# EAGLE design cerebro5.11_dbs (EAGLE 9.1.3)
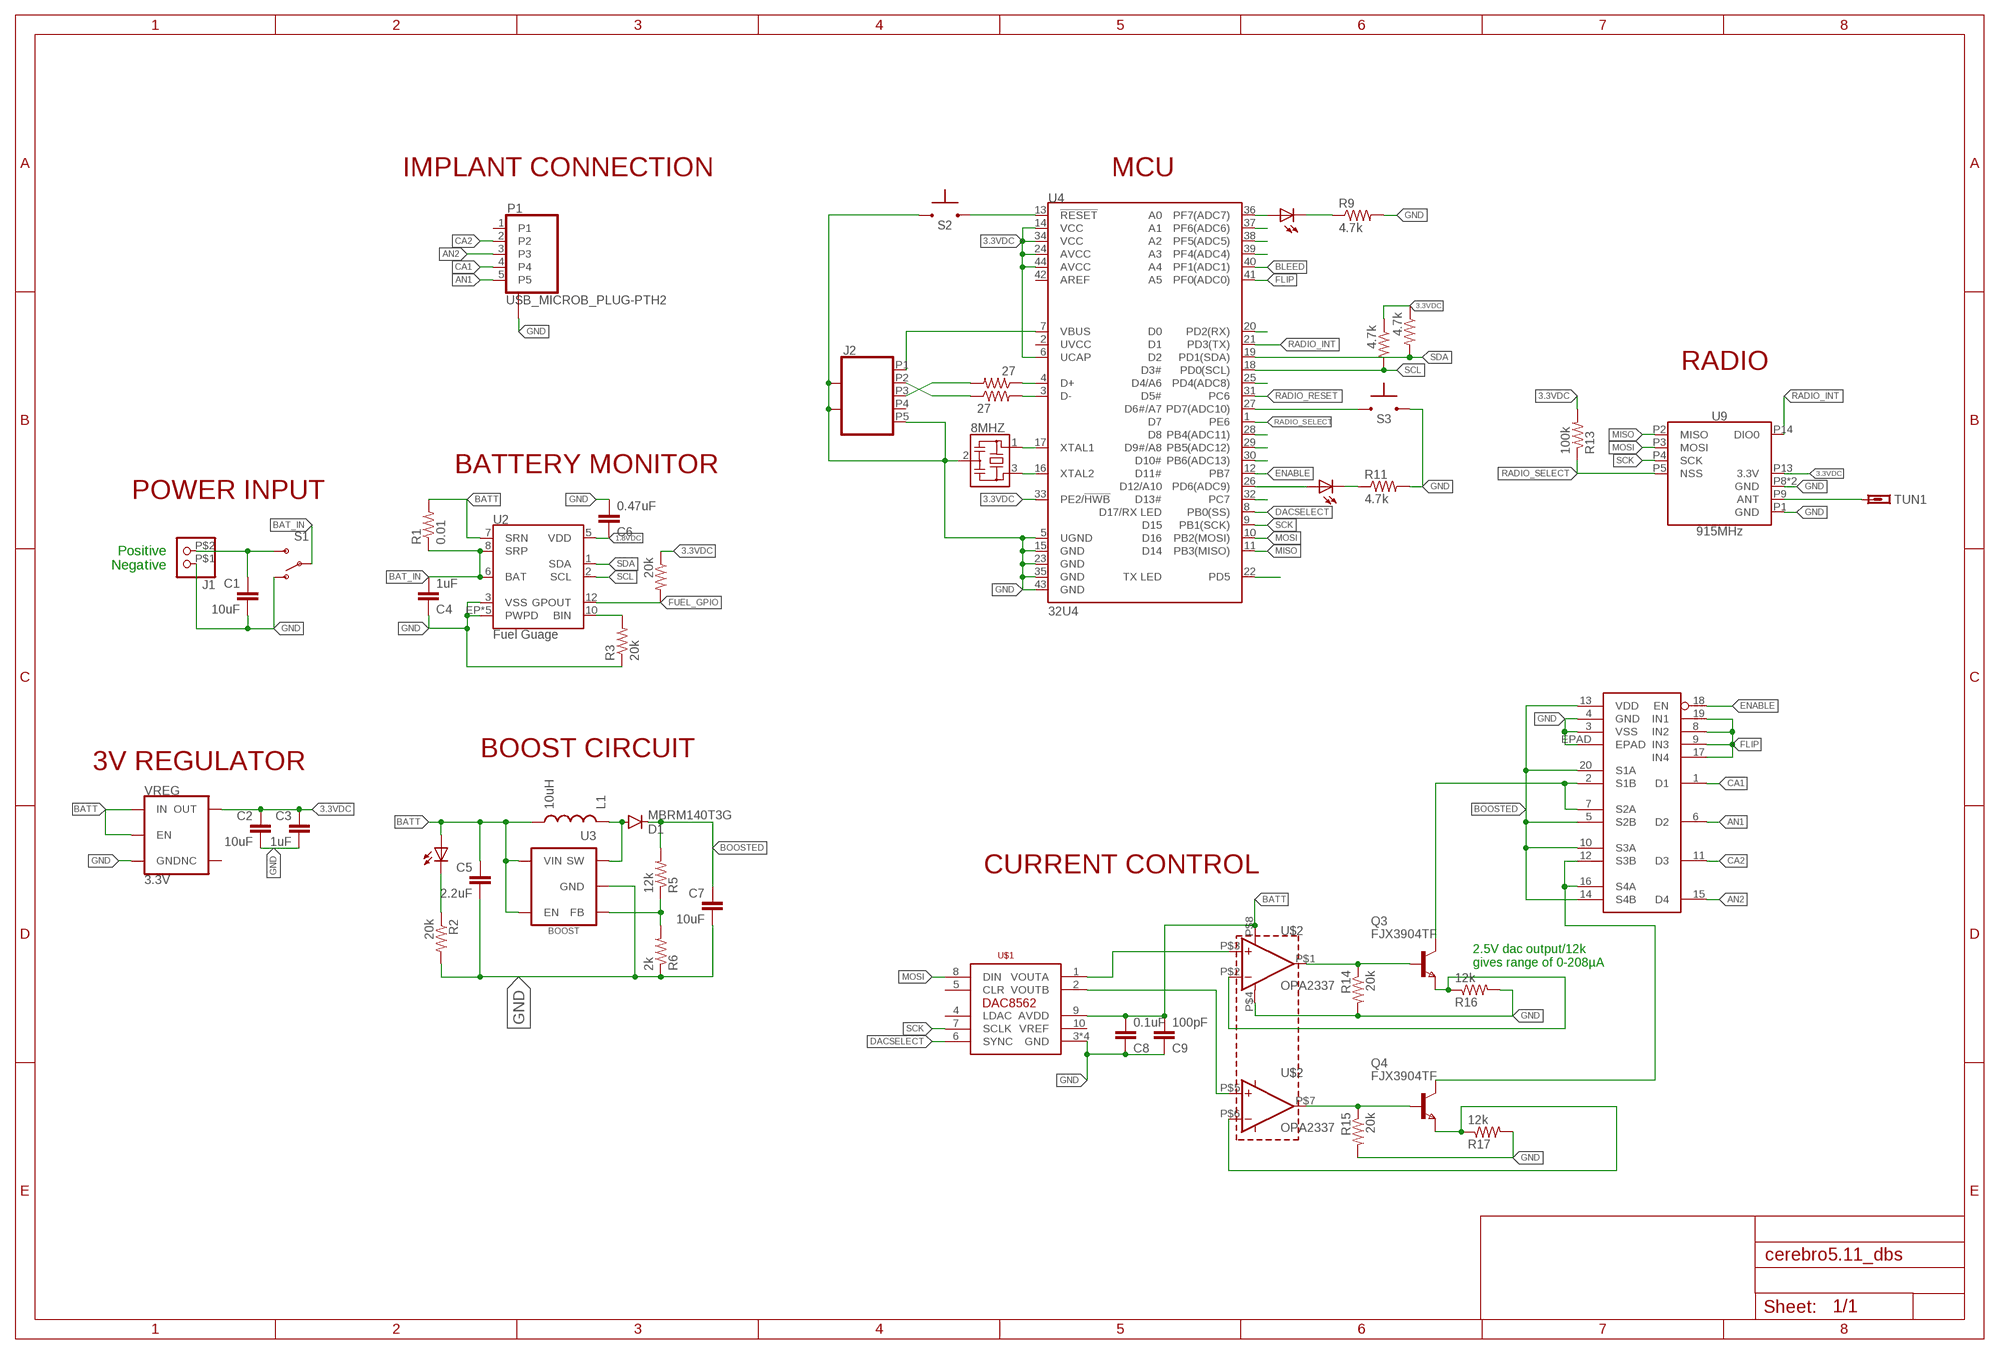
[diagram p0: schematic, sheet 1]

## Parts
8MHZ  RESONATOR_CSTCE_V  [CSTCE_V]
C1  10uF  10UF-0805-10V-10%  [0805]
C2  10uF  10UF-0805-10V-10%  [0805]
C3  1uF  10UF-0805-10V-10%  [0805]
C4  1uF  10UF-0805-10V-10%  [0805]
C5  2.2uF  2.2UF-0805-25V-(+80/-20%)  [0805]
C6  0.47uF  10UF-0805-10V-10%  [0805]
C7  10uF  10UF-0805-10V-10%  [0805]
C8  0.1uF  10UF-0805-10V-10%  [0805]
C9  100pF  10UF-0805-10V-10%  [0805]
D1  MBRM140T3G  DIODEPOWERMITE  [POWERMITE]
J1  JST_2PINMICRO  [MICRO_LOCK_2PIN]
J2  USB_MICRO_SOCKET_HORZ_REINFORCED  [USB_HORZ_REINFORCED_MICRO]
L1  10uH  INDUCTORLQH4  [1812]
LED1  RED  LEDCHIP-LED0603  [CHIP-LED0603]
LED2  YLW  LEDCHIP-LED0603  [CHIP-LED0603]
LED3  YLW  LEDCHIP-LED0603  [CHIP-LED0603]
P1  USB_MICROB_PLUG-PTH2  [MICRO-B-TH]
Q3  FJX3904TF  NPNSOT323  [SOT323]
Q4  FJX3904TF  NPNSOT323  [SOT323]
R1  0.01  RESISTOR1206  [1206]
R2  20k  RESISTOR0603-RES  [0603-RES]
R3  20k  RESISTOR0603-RES  [0603-RES]
R4  20k  RESISTOR0603-RES  [0603-RES]
R5  12k  RESISTOR0805-RES  [0805]
R6  2k  RESISTOR0603-RES  [0603-RES]
R7  27  RESISTOR0603-RES  [0603-RES]
R8  27  RESISTOR0603-RES  [0603-RES]
R9  4.7k  RESISTOR0603-RES  [0603-RES]
R10  4.7k  RESISTOR0603-RES  [0603-RES]
R11  4.7k  RESISTOR0603-RES  [0603-RES]
R12  4.7k  RESISTOR0603-RES  [0603-RES]
R13  100k  RESISTOR0603-RES  [0603-RES]
R14  20k  RESISTOR0603-RES  [0603-RES]
R15  20k  RESISTOR0603-RES  [0603-RES]
R16  12k  RESISTOR0603-RES  [0603-RES]
R17  12k  RESISTOR0603-RES  [0603-RES]
S1  SWITCH-SPDTREINFORCED_SMD  [SWITCH-SPDT-SMD-REINFORCED]
S2  SWITCH-MOMENTARY-NO  [SWITCH_MOMENTARY_XS]
S3  SWITCH-MOMENTARY-NO  [SWITCH_MOMENTARY_XS]
TUN1  ANTENNA  [1X01]
U2  Fuel Guage  BQ27441-G1  [PDSO-N12]
U3  BOOST  BOOST_CONVERTER  [SOT23-5]
U4  32U4  ATMEGA32U4QFN2  [QFN-44-NOPAD]
U9  915MHz  RFM69HCW-915  [RFM69HCW-XXXS2]
U$1  DAC8562  [WSON-10]
U$2  OPA2337  [SOT23-8]
U$3  ADG1434  [LFCSP_5X5]
VREG  3.3V  V_REG_AP2112K-3.3V  [SOT23-5]

## Nets
1.8VDC: C6.1 U2.5(VDD)
3.3VDC: C2.1 C3.1 R4.1 R10.1 R12.1 R13.2 U4.6(UCAP) U4.14(VCC) U4.24(AVCC) U4.33(PE2/!HWB) U4.34(VCC) U4.44(AVCC) U9.P13(3.3V) VREG.5(OUT)
AN1: P1.5 U$3.6(D2)
AN2: P1.3 U$3.15(D4)
BAT_IN: C4.2 R1.1 S1.2(P) U2.6(BAT) U2.8(SRP)
BATT: C5.1 C8.2 C9.2 L1.P$2 L1.P$4 LED1.A R1.2 U2.7(SRN) U3.4(EN) U3.5(VIN) U$1.9(AVDD) U$2.P$8(V+) VREG.1(IN) VREG.3(EN)
BLEED: U4.40(PF1(ADC1))
BOOSTED: C7.1 D1.CATHODE(C) R5.2 U$3.5(S2B) U$3.10(S3A) U$3.13(VDD) U$3.14(S4B) U$3.20(S1A)
CA1: P1.4 U$3.1(D1)
CA2: P1.2 U$3.11(D3)
DACSELECT: U4.8(PB0(SS)) U$1.6(SYNC)
ENABLE: U4.12(PB7) U$3.18(EN)
FLIP: U4.41(PF0(ADC0)) U$3.8(IN2) U$3.9(IN3) U$3.17(IN4) U$3.19(IN1)
FUEL_GPIO: R4.2 U2.12(GPOUT)
GND: 8MHZ.2 C1.2 C2.2 C3.2 C4.1 C5.2 C6.2 C7.2 C8.1 C9.1 J1.P$1 J2.G1 J2.G2 J2.P5 J2.P$1 J2.P$2 P1.P$1(GND_PINS) P1.P$2(GND_PINS) R2.2 R3.1 R6.1 R9.2 R11.2 R14.2 R15.2 R16.2 R17.2 S1.1(O) S2.P$1 S3.P$2 U2.3(VSS) U2.EP1(PWPD) U2.EP2(PWPD) U2.EP3(PWPD) U2.EP4(PWPD) U2.EP(PWPD) U3.2(GND) U4.5(UGND) U4.15(GND) U4.23(GND) U4.35(GND) U4.43(GND) U9.P1(GND) U9.P8(GND) U9.P10(GND) U$1.3(GND) U$1.G1(GND) U$1.G2(GND) U$1.G3(GND) U$2.P$4(V-) U$3.3(VSS) U$3.4(GND) U$3.EPAD VREG.2(GND)
MISO: U4.11(PB3(MISO)) U9.P2(MISO)
MOSI: U4.10(PB2(MOSI)) U9.P3(MOSI) U$1.8(DIN)
N$1: Q3.2(B) R14.1 U$2.P$1(OUTA)
N$2: Q4.2(B) R15.1 U$2.P$7(OUTB)
N$3: Q4.3(E) R17.1 U$2.P$6(INB-)
N$4: C1.1 J1.P$2 S1.3(S)
N$5: Q3.3(E) R16.1 U$2.P$2(INA-)
N$8: LED1.C R2.1
N$9: U4.32(PC7)
N$10: R5.1 R6.2 U3.3(FB)
N$12: 8MHZ.1 U4.17(XTAL1)
N$13: 8MHZ.3 U4.16(XTAL2)
N$14: J2.P1 U4.7(VBUS)
N$15: D1.ANODE(A) L1.P$1 L1.P$3 U3.1(SW)
N$16: R7.1 U4.4(D+)
N$17: R8.2 U4.3(D-)
N$18: J2.P3 R7.2
N$19: J2.P2 R8.1
N$20: LED3.C R11.1
N$21: S3.P$1 U4.27(PD7(ADC10))
N$22: TUN1.1 U9.P9(ANT)
N$23: U4.37(PF6(ADC6))
N$24: LED2.C R9.1
N$25: LED2.A U4.36(PF7(ADC7))
N$26: R3.2 U2.10(BIN)
N$27: U4.22(PD5)
N$28: Q4.1(C) U$3.12(S3B) U$3.16(S4A)
N$29: LED3.A U4.26(PD6(ADC9))
N$30: U4.30(PB6(ADC13))
N$31: U4.25(PD4(ADC8))
N$32: U$1.1(VOUTA) U$2.P$3(INA+)
N$33: U$1.2(VOUTB) U$2.P$5(INB+)
N$34: U4.29(PB5(ADC12))
N$36: Q3.1(C) U$3.2(S1B) U$3.7(S2A)
N$37: U4.28(PB4(ADC11))
N$39: U4.20(PD2(RX))
N$42: U4.39(PF4(ADC4))
N$44: U4.38(PF5(ADC5))
RADIO_INT: U4.21(PD3(TX)) U9.P14(DIO0)
RADIO_RESET: U4.31(PC6)
RADIO_SELECT: R13.1 U4.1(PE6) U9.P5(NSS)
RESET: S2.P$2 U4.13(!RESET)
SCK: U4.9(PB1(SCK)) U9.P4(SCK) U$1.7(SCLK)
SCL: R10.2 U2.2(SCL) U4.18(PD0(SCL))
SDA: R12.2 U2.1(SDA) U4.19(PD1(SDA))
Unconnected: J2.P4 P1.1 U4.2(UVCC) U4.42(AREF) U$1.4(LDAC) U$1.5(CLR) U$1.10(VREF) VREG.4(NC)

## Notes on the sheet
- IMPLANT CONNECTION | MCU
- RADIO
- BATTERY MONITOR
- POWER INPUT
- Positive
- Negative
- BOOST CIRCUIT
- 3V REGULATOR
- CURRENT CONTROL
- 2.5V dac output/12k 
  gives range of 0-208µA

## Library data of the parts
8MHZ = Cerebro-library:RESONATOR: 16 MHz Resonator(Murata p/n CSTCE16M0V53-R0) Digikey: 490-1198-1-ND <http://www.digikey.com/product-search/en?keywords=490-1198-1-nd>
C1 C2 C7 = Cerebro-library:10UF: 10.0µF ceramic capacitors A capacitor is a passive two-terminal electrical component used to store electrical energy temporarily in an electric field.; PROD_ID: CAP-11330
C3 C4 C6 C8 C9 = Cerebro-library:10UF: 10.0µF ceramic capacitors A capacitor is a passive two-terminal electrical component used to store electrical energy temporarily in an electric field.; PROD_ID: CAP-11330; VALUE: 10uF
C5 = Cerebro-library:2.2UF: 2.2µF ceramic capacitors A capacitor is a passive two-terminal electrical component used to store electrical energy temporarily in an electric field.; PROD_ID: CAP-11624
D1 = Cerebro-library:DIODE: Diode These are standard reverse protection diodes and small signal diodes. SMA package can handle up to about 1A. SOD-323 can handle about 200mA. What the SOD-323 package when ordering, there are some mfgs out there that are 5-pin packages.
J1 = Cerebro-library:JST_2PIN: JST 2-Pin Connectors of various flavors SMT-RA (S2B-PH-SM4) 4UConnector #17311 SMT (B2B-PH-SM4) THM-RA (S2B-PH) THM (B2B-PH)
J2 = Cerebro-library:USB_MICRO_SOCKET: horizontal socket. Digikey 609-4616-1-ND
L1 = Cerebro-library:INDUCTOR: Inductors Basic Inductor/Choke - 0603 and 1206. Footprints are not proven and vary greatly between part numbers. SRN6045- 33uH, 20% 1.4A SDR0403-560KL - 56uH, 10%, 500mA RMS/740mA peak
LED1-LED3 = led:LED: LED OSRAM: - CHIPLED LG R971, LG N971, LY N971, LG Q971, LY Q971, LO R971, LY R971 LH N974, LH R974 LS Q976, LO Q976, LY Q976 LO Q996 - Hyper CHIPLED LW Q18S LB Q993, LB Q99A, LB R99A - SideLED LS A670, LO A670, LY A670, LG A670, LP A670 LB A673, LV A673, LT A673, LW A673 LH A674 LY A675 LS A676, LA A676, LO A676, LY A676, LW A676 LS A679, LY A679, LG A679 - Hyper Micro SIDELED® LS Y876, LA Y876, LO Y876, LY Y876 LT Y87S - SmartLED LW L88C, LW L88S LB L89C, LB L89S, LG L890 LS L89K, LO L89K, LY L89K LS L896, LA L896, LO L896, LY L896 - TOPLED LS T670, LO T670, LY T670, LG T670, LP T670 LSG T670, LSP T670, LSY T670, LOP T670, LYG T670 LG T671, LOG T671, LSG T671 LB T673, LV T673, LT T673, LW T673 LH T674 LS T676, LA T676, LO T676, LY T676, LB T676, LH T676, LSB T676, LW T676 LB T67C, LV T67C, LT T67C, LS T67K, LO T67K, LY T67K, LW E67C LS E67B, LA E67B, LO E67B, LY E67B, LB E67C, LV E67C, LT E67C LW T67C LS T679, LY T679, LG T679 LS T770, LO T770, LY T770, LG T770, LP T770 LB T773, LV T773, LT T773, LW T773 LH T774 LS E675, LA E675, LY E675, LS T675 LS T776, LA T776, LO T776, LY T776, LB T776 LHGB T686 LT T68C, LB T68C - Hyper Mini TOPLED® LB M676 - Mini TOPLED Santana® LG M470 LS M47K, LO M47K, LY M47K Source: http://www.osram.convergy.de LUXEON: - LUMILED® LXK2-PW12-R00, LXK2-PW12-S00, LXK2-PW14-U00, LXK2-PW14-V00 LXK2-PM12-R00, LXK2-PM12-S00, LXK2-PM14-U00 LXK2-PE12-Q00, LXK2-PE12-R00, LXK2-PE12-S00, LXK2-PE14-T00, LXK2-PE14-U00 LXK2-PB12-K00, LXK2-PB12-L00, LXK2-PB12-M00, LXK2-PB14-N00, LXK2-PB14-P00, LXK2-PB14-Q00 LXK2-PR12-L00, LXK2-PR12-M00, LXK2-PR14-Q00, LXK2-PR14-R00 LXK2-PD12-Q00, LXK2-PD12-R00, LXK2-PD12-S00 LXK2-PH12-R00, LXK2-PH12-S00 LXK2-PL12-P00, LXK2-PL12-Q00, LXK2-PL12-R00 Source: www.luxeon.com KINGBRIGHT: KA-3528ASYC Source: www.kingbright.com
P1 = Cerebro-library:USB_MICROB_PLUG: USB Micro-B connectors Some male, some female. Watch your step!
Q3 Q4 = Cerebro-library:NPNSOT323: NPN TRANSISTOR; MPN: DSS4160U-7; OC_FARNELL: 1710696; OC_NEWARK: 25R4558
R1-R17 = Cerebro-library:RESISTOR: Resistor Basic schematic elements and footprints for 0603, 1206, and PTH resistors.
S1 = Cerebro-library:SWITCH-SPDT: SPDT Switch slide switch: AYZ0102AGRLC <http://www.digikey.com/product-detail/en/c-k/AYZ0102AGRLC/401-2012-1-ND/1640121> vertical toggle: ATE1D-2M3-10-Z <http://www.digikey.com/product-search/en?keywords=ATE1D-2M3-10-Z> horizontal toggle: ATE1D-5M3-10-Z <http://www.digikey.com/product-search/en?keywords=ATE1D-5M3-10-Z>
S2 S3 = Cerebro-library:SWITCH-MOMENTARY-NO
TUN1 = Cerebro-library:ANTENNA
U2 = Cerebro-library:BQ27441-G1: Texas Instruments BQ27441-G1 LiPo Battery Fuel Gauge The Texas Instruments bq27441-G1 fuel gauge is a microcontroller peripheral that provides system-side fuel gauging for single-cell Li-Ion batteries. The device requires minimal user configuration and system microcontroller firmware development. The bq27441-G1 battery fuel gauge uses the patented Impedance Track™ algorithm for fuel gauging, and provides information such as remaining battery capacity (mAh), state-of-charge (%), and battery voltage (mV). Datasheet <http://www.ti.com/product/BQ27441-G1/datasheet> SparkFun Products SparkFun Battery Babysitter <https://www.sparkfun.com/products/13777> (PRT-13777); PROD_ID: IC-13220
U3 = Cerebro-library:BOOST_CONVERTER
U4 = Cerebro-library:ATMEGA32U4: Atmel MCU, 32KByte Atmel 44-pin 8-bit Microcontroller with 32KBytes of ISP Flash and USB Controller Datasheet <http://cdn.sparkfun.com/datasheets/Dev/Arduino/Boards/ATMega32U4.pdf> SparkFun Products LilyPad Arduino USB - ATmega32U4 Board <https://www.sparkfun.com/products/12049> (DEV-12049) Pro Micro - 5V/16MHz <https://www.sparkfun.com/products/12640> (DEV-12640) Pro Micro - 3.3V/8MHz <https://www.sparkfun.com/products/12587> (DEV-12587) Fio v3 - ATmega32U4 <https://www.sparkfun.com/products/11520> (DEV-11520) Qduino Mini <https://www.sparkfun.com/products/13614> (DEV-13614) Makey Makey - Standard Kit <https://www.sparkfun.com/products/11511> (WIG-11511) Makey Makey Deluxe Kit <https://www.sparkfun.com/products/11519> (WIG-11519); PROD_ID: IC-10828
U9 = Cerebro-library:RFM69H: Hope RF RFM69H ISM Transceiver Module The RFM69H is a transceiver module capable of operation over a wide frequency range, including the 315,433,868 and 915MHz license-free ISM (Industry Scientific and Medical) frequency bands. All major RF communication parameters are programmable and most of them can be dynamically set. The RFM69H offers the unique advantage of programmable narrow-band and wide- band communication modes. The RFM69H is optimized for low power consumption while offering high RF output power and channelized operation.Compliance ETSI and FCC regulations. Datasheet <http://www.hoperf.cn/upload/docs/RF/SX/RFM69H_DataSheet_v1.3.pdf> SparkFun Products RFM69HCW Wireless Transceiver - 915MHz <https://www.sparkfun.com/products/13909> (COM-13909) RFM69HCW Wireless Transceiver - 434MHz <https://www.sparkfun.com/products/13910> (COM-13910) SparkFun RFM69 Breakout (915MHz) <https://www.sparkfun.com/products/12775> (WRL-12775) SparkFun RFM69 Breakout (434MHz) <https://www.sparkfun.com/products/12823> (WRL-12823); PROD_ID: IC-11997
U$1 = Cerebro-library:DAC8562: DAC8562
U$2 = Cerebro-library:OPA2337: Texas instruments OPA2337 dual op-amp. SOT23-8 Digikey 296-26252-1-ND <https://www.digikey.com/products/en?keywords=296-26252-1-ND>
U$3 = Cerebro-library:ADG1434
VREG = Cerebro-library:V_REG_AP2112: AP2112 - 600mA CMOS LDO Regulator w/ Enable The AP2112 is CMOS process low dropout linear regulator with enable function, the regulator delivers a guaranteed 600mA (min.) continuous load current. Features Output Voltage Accuracy: ±1.5% Output Current: 600mA (Min.) Foldback Short Current Protection: 50mA Enable Function to Turn ON/OFF VOUT Low Dropout Voltage (3.3V): 250mV (Typ.) @IOUT=600mA Excellent Load Regulation: 0.2%/A (Typ.) Excellent Line Regulation: 0.02%/V (Typ.) Low Quiescent Current: 55μA (Typ.) Low Standby Current: 0.01μA (Typ.) Low Output Noise: 50μVRMS PSRR: 100Hz -65dB, 1kHz -65dB OTSD Protection Stable with 1.0μF Flexible Cap: Ceramic, Tantalum and Aluminum Electrolytic Operation Temperature Range: -40°C to 85°C ESD: MM 400V, HBM 4000V; DIGIKEY: AP2112K-3.3TRG1DICT-ND; PROD_ID: VREG-12457

## Board
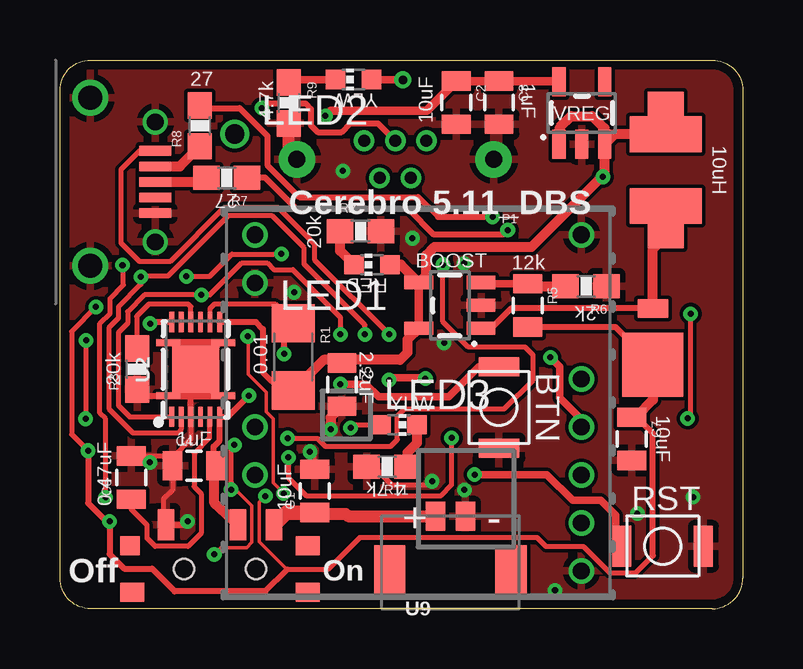
[diagram p1: board, top side]
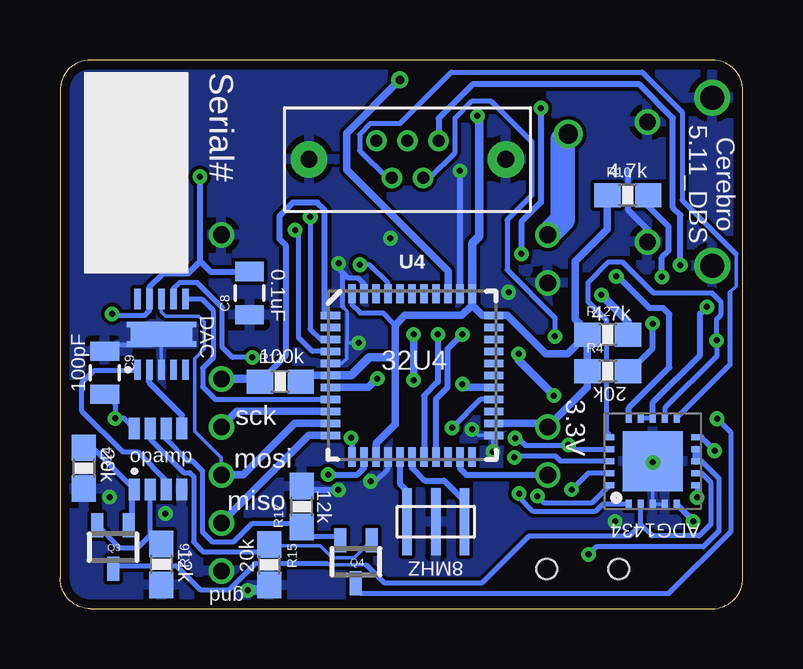
[diagram p2: board, bottom side, seen from below]

Size 28.45 x 22.86 mm. Coordinates in mm from the lower left corner, seen from the top.
Outline: 27.18,0 1.27,0 arc-90 0,1.27 0,21.59 arc-90 1.27,22.86 27.18,22.86 arc-90 28.45,21.59 28.45,1.27 arc-90 27.18,0
Copper layers (1*16): Top 0.0356mm / dielectric 1.5011mm / Bottom 0.0356mm
Design rules "LaenPCBOrder *": minimum track width 6mil, minimum drill 8mil, track to track 6mil, track to pad 6mil, pad to pad 6mil, via to via 6mil, smd to smd 0mil, copper to edge 15mil, drill to drill 6mil, minimum pad ring 7mil, minimum via ring 7mil, stop-mask expansion 3mil, vias tented up to drill 25mil, thermal gap 10mil
bRestrict: area 23.6,14.9 to 26.9,21.6

### Footprints (pad centres in the part's own frame; a part is rotated, then mirrored left to right if it is on the bottom)
CSTCE_V = smd 0.4 x 2.794: 1 -1.2,0; 2 0,0; 3 1.2,0
0805 = smd 0.8 x 1.2: 1 -0.9,0; 2 0.9,0
POWERMITE = smd 0.762 x 1.27: ANODE 0.699,0 | smd 2.667 x 2.54: CATHODE -1.651,0
MICRO_LOCK_2PIN = smd 0.8 x 1.2: P$1 -0.625,0; P$2 0.625,0 | smd 1.3 x 2.15: P$3 -2.525,2.295; P$4 2.525,2.295
USB_HORZ_REINFORCED_MICRO = drill 1: G1 -3.5,0; G2 3.5,0 | smd 0.4 x 1.35: P1 -1.3,2.7; P2 -0.65,2.7; P3 0,2.7; P4 0.65,2.7; P5 1.3,2.7 | drill 0.7: P$1 -2.5,2.7; P$2 2.5,2.7
1812 = smd 1.499 x 2.997: P$1 -1.499,0; P$2 1.499,0 | smd 1.016 x 1.499: P$3 -2.756,0; P$4 2.756,0
CHIP-LED0603 = smd 0.8 x 0.8: A 0,-0.75; C 0,0.75
MICRO-B-TH = drill 0.5 pad 0.813: 1 -1.3,-0.775; 2 -0.65,0.775; 3 0,-0.775; 4 0.65,0.775; 5 1.3,-0.775 | drill 0.7 pad 1.524: P$1 -4.1,0; P$2 4.1,0
SOT323 = smd 0.5 x 1: 1 0,0.9; 2 -0.65,-0.9; 3 0.65,-0.9
1206 = smd 1.6 x 1.8: 1 -1.4,0; 2 1.4,0
0603-RES = smd 1.1 x 1: 1 -0.85,0; 2 0.85,0
SWITCH-SPDT-SMD-REINFORCED = smd 0.7 x 1.3: 1 -2.25,1.85; 2 0.75,1.85; 3 2.25,1.85 | smd 0.8 x 0.8: P$4 -3.75,0.965 | smd 1 x 0.8: P$5 -3.65,-0.965; P$6 3.65,0.965; P$7 3.65,-0.965 | hole 0.85: -1.5,0; 1.5,0
SWITCH_MOMENTARY_XS = smd 0.8 x 1.7: P$1 -1.7,0; P$2 1.7,0
1X01 = drill 0.8: 1 0,0
PDSO-N12 = smd 0.2 x 0.85: 1 -1,-1.975; 2 -0.6,-1.975; 3 -0.2,-1.975; 4 0.2,-1.975; 5 0.6,-1.975; 6 1,-1.975; 7 1,1.975; 8 0.6,1.975; 9 0.2,1.975; 10 -0.2,1.975; 11 -0.6,1.975; 12 -1,1.975 | smd 1.95 x 1.95: EP 0,0 | smd 1 x 0.25: EP1 -1.15,1.1; EP2 -1.15,-1.1; EP3 1.15,-1.1; EP4 1.15,1.1
SOT23-5 = smd 0.55 x 1.2: 1 -0.95,-1.3; 2 0,-1.3; 3 0.95,-1.3; 4 0.95,1.3; 5 -0.95,1.3
QFN-44-NOPAD = smd 0.8 x 0.3: 1 -3.4,2.5; 2 -3.4,2; 3 -3.4,1.5; 4 -3.4,1; 5 -3.4,0.5; 6 -3.4,0; 7 -3.4,-0.5; 8 -3.4,-1; 9 -3.4,-1.5; 10 -3.4,-2; 11 -3.4,-2.5; 23 3.4,-2.5; 24 3.4,-2; 25 3.4,-1.5; 26 3.4,-1; 27 3.4,-0.5; 28 3.4,0; 29 3.4,0.5; 30 3.4,1; 31 3.4,1.5; 32 3.4,2; 33 3.4,2.5 | smd 0.3 x 0.8: 12 -2.5,-3.4; 13 -2,-3.4; 14 -1.5,-3.4; 15 -1,-3.4; 16 -0.5,-3.4; 17 0,-3.4; 18 0.5,-3.4; 19 1,-3.4; 20 1.5,-3.4; 21 2,-3.4; 22 2.5,-3.4; 34 2.5,3.4; 35 2,3.4; 36 1.5,3.4; 37 1,3.4; 38 0.5,3.4; 39 0,3.4; 40 -0.5,3.4; 41 -1,3.4; 42 -1.5,3.4; 43 -2,3.4; 44 -2.5,3.4
RFM69HCW-XXXS2 = drill 0.7: P1 -6.8,7; P2 -6.8,5; P3 -6.8,3; P4 -6.8,1; P5 -6.8,-1; P8 -6.8,-7; P9 6.8,-7; P10 6.8,-5; P13 6.8,1; P14 6.8,3
WSON-10 = smd 0.28 x 0.85: 1 -1,-1.475; 2 -0.5,-1.475; 3 0,-1.475; 4 0.5,-1.475; 5 1,-1.475; 6 1,1.475; 7 0.5,1.475; 8 0,1.475; 9 -0.5,1.475; 10 -1,1.475 | smd 2.55 x 0.59: G1 0,0 | smd 2.91 x 0.23: G2 0,0.41; G3 0,-0.41
SOT23-8 = smd 0.889 x 0.457: P$1 -1.27,0.991; P$2 -1.27,0.33; P$3 -1.27,-0.33; P$4 -1.27,-0.991; P$5 1.27,-0.991; P$6 1.27,-0.33; P$7 1.27,0.33; P$8 1.27,0.991
LFCSP_5X5 = smd 0.4 x 0.25: 1 -1.8,1; 2 -1.8,0.5; 3 -1.8,0; 4 -1.8,-0.5; 5 -1.8,-1; 11 1.8,-1; 12 1.8,-0.5; 13 1.8,0; 14 1.8,0.5; 15 1.8,1 | smd 0.25 x 0.4: 6 -1,-1.8; 7 -0.5,-1.8; 8 0,-1.8; 9 0.5,-1.8; 10 1,-1.8; 16 1,1.8; 17 0.5,1.8; 18 0,1.8; 19 -0.5,1.8; 20 -1,1.8 | smd 2.5 x 2.5: EPAD 0,0

### Placement (x,y rotation side)
8MHZ  12.79,3.62 180 bottom
C1  10.62,4.9 90 top
C2  16.51,21.08 270 top
C3  18.29,21.08 270 top
C4  5.59,5.96 0 top
C5  11.75,9.33 270 top
C6  2.97,5.46 90 top
C7  23.83,7.07 270 top
C8  20.55,13.14 90 bottom
C9  26.58,9.83 270 bottom
D1  24.7,11.81 90 top
J1  16.27,3.85 180 top
J2  1.27,17.78 270 top
L1  25.25,18.28 90 top
LED1  13,14.33 90 top
LED2  12.23,22.05 90 top
LED3  14.12,7.66 270 top
P1  13.97,18.72 180 top
Q3  26.24,2.57 180 bottom
Q4  16.12,1.96 180 bottom
R1  9.72,10.49 270 top
R2  12.52,15.72 0 top
R3  3.21,9.98 90 top
R4  5.63,9.89 0 bottom
R5  19.49,12.64 270 top
R6  21.92,13.44 180 top
R7  6.95,17.96 180 top
R8  5.83,20.12 90 top
R9  9.54,21.07 270 top
R10  4.79,17.22 0 bottom
R11  13.63,5.92 180 top
R12  5.63,11.42 0 bottom
R13  19.27,9.46 0 bottom
R14  27.46,5.85 270 bottom
R15  19.74,1.83 270 bottom
R16  24.22,1.84 270 bottom
R17  18.38,4.25 90 bottom
S1  6.67,1.65 0 top
S2  25.11,2.6 180 top
S3  18.29,8.38 270 top
TUN1  7.28,19.77 0 bottom
U2  5.65,9.97 0 top
U3  16.24,12.64 90 top
U4  13.78,9.72 0 bottom
U9  14.92,8.57 180 top
U$1  24.22,11.43 0 bottom
U$2  24.36,6.24 90 bottom
U$3  3.75,6.15 90 bottom
VREG  21.74,20.65 0 top

### Tracks (layer width: path | path; a pad name or v marks a point on that pad's centre or on a via)
1.8VDC
  Top 0.152: U2.5 6.22,7.97
  Top 0.203: 6.22,7.97 6.22,7.11 5.59,6.48 5.59,5.08 5.88,4.79 5.88,3.13 5.34,2.6 3.96,2.6 3.63,2.93 3.63,3.48 2.97,4.14 C6.1
3.3VDC  (via drill 0.25)
  Top 0.305: 20.76,21.98 VREG.5
  Top 0.356: 20.76,21.98 C3.1 C2.1 15.28,20.75 11.28,20.75 v11.06,20.54
  Bottom 0.152: 6.41,11.49 R12.1
  Bottom 0.203: 14.48,11.81 14.99,12.32 15.94,12.32 16.28,12.66 16.28,12.67 U4.44 | 6.48,9.93 R4.1
  Bottom 0.254: 9.87,7.71 9.86,7.73
  Bottom 0.305: U4.14 15.28,6.88 14.48,7.68 14.48,10.48 14.48,11.81 14.07,12.22 11.7,12.22 11.28,12.63 10.86,12.22 U4.33 9.81,12.22 8.2,10.61 7.28,10.61 R12.1 6.48,9.93 6.48,9.22 U9.P13 8.28,7.73 9.86,7.73 | 6.41,11.49 6.99,12.06 6.99,14.46 5.64,15.81 R10.1 | U4.6 18.16,9.72 R13.2 | U4.24 9.87,7.71
  Bottom 0.356: U4.6 16.32,9.72 15.56,10.48 14.48,10.48 | 11.28,12.63 U4.34 11.28,15.22 10.99,15.52 10.99,20.46 v11.06,20.54
AN1  (via drill 0.25)
  Top 0.203: v1.9,4.63 1.9,7.9 1.66,8.15 1.66,11.88 2.08,12.31 2.08,12.92 2.64,13.47 2.64,14.28 v2.6,14.31
  Bottom 0.203: U$3.6 1.9,5.1 v1.9,4.63
  Bottom 0.254: v2.6,14.31 2.6,16.4 2.91,16.71 2.91,20.43 4.32,21.84 11.25,21.84 12.67,20.43 P1.5
AN2  (via drill 0.25)
  Top 0.203: v5.27,13.84 6.23,13.84 7.16,14.77 v9.21,14.77 v9.22,14.78
  Top 0.254: P1.3 13.25,20.22 12.1,20.22 11.73,19.85 10.74,19.85 10.46,20.14 10.46,20.82 10.23,21.05 8.6,21.05 v8.41,20.85
  Bottom 0.254: v8.41,20.85 8.41,16.93 9.22,16.12 v9.22,14.78 | U$3.15 4.75,8.36 3.06,10.05 3.06,12.27 3.31,12.52 3.88,12.52 5.21,13.84 v5.27,13.84
BAT_IN  (via drill 0.25)
  Top 0.203: U2.8 6.25,12.51 6.44,12.7 8.96,12.7 9.64,12.03
  Top 0.254: C4.2 6.4,5.96 | v7.87,8.88 6.99,8 U2.6 6.65,7 6.4,6.75 6.4,5.96 | v9.34,10.62 9.34,11.51 R1.1 | 6.4,5.96 6.4,5.64 6.44,5.64
  Top 0.305: 9.64,12.03 R1.1
  Top 0.406: S1.2 6.44,4.41 6.44,5.64
  Bottom 0.33: v7.87,8.88 v7.87,8.89 9.34,10.35 v9.34,10.62
BATT  (via drill 0.25, 0.25 pad 0.25)
  Top 0.203: v26.15,7.92 26.28,8.05 v26.28,12.28 | VREG.1 20.83,19.39
  Top 0.254: L1.P$4 L1.P$2 | 9.2,9.09 8.46,9.83 8.46,11.65 8.16,11.94 U2.7
  Top 0.356: U3.4 U3.5 | 9.2,9.09 R1.2
  Top 0.406: L1.P$2 23.12,19.77 23.01,19.66 VREG.3 | U3.5 14.48,11.22 14.48,10.67 14.17,10.36 11.75,10.36 C5.1 11.63,10.36 10.99,10.36 R1.2 | VREG.3 22.69,18.07 v22.62,18 22.57,18 19.65,15.07 15.6,15.07 15.26,14.73 15.26,13.9 U3.4 14.2,14.33 LED1.A | 20.83,19.39 20.83,20.05 21.3,20.52 22.17,20.52 22.68,20.02 22.68,19.36 VREG.3
  Bottom 0.152: C9.2 26.15,8.5
  Bottom 0.203: U$2.P$8 25.77,7.92 v26.15,7.92 26.15,8.5 | U$1.9 24.72,12.42 24.93,12.21 26.2,12.21 v26.28,12.28
  Bottom 0.254: U$1.9 24.72,13.38 24.13,13.97 23.11,13.97 22.61,14.48 | v22.62,18 22.61,17.98 22.61,14.48 | 22.61,14.48 22.17,14.04 C8.2
BOOSTED  (via drill 0.25)
  Top 0.152: v8.56,4.69 8.31,4.44 8.31,2.79 9.47,1.63
  Top 0.203: v1.5,12.57 0.48,11.55 0.48,7.26 v1.17,6.58 | 24.7,2.21 24,1.5 22.9,1.5 21.82,2.58 20.25,2.58 19.88,2.96 12.48,2.96 11.15,1.63 9.47,1.63 | 8.55,0.72 8.56,0.72
  Top 0.254: C7.1 23.93,8.08 24,8 24.7,7.3 24.7,6.69 24.7,2.21 | v1.17,6.58 1.17,4.39 1.93,3.63 v2.07,3.63 2.07,2.27 2.67,1.66 3.83,1.66 4.78,0.72 8.55,0.72 | R5.2 23.12,11.74 D1.CATHODE | 8.56,0.72 9.47,1.63
  Top 0.406: D1.CATHODE 24.7,8.7 24,8
  Bottom 0.203: U$3.14 U$3.13 | U$3.20 6.3,4.4 8.27,4.4 v8.56,4.69
  Bottom 0.254: U$3.5 2.07,3.67 v2.07,3.63 | U$3.13 3.75,8.6 1.78,10.57 1.78,12.29 v1.5,12.57 | v1.17,6.58 1.47,6.88 1.47,6.89 1.73,7.15 U$3.10
CA1  (via drill 0.25)
  Top 0.152: v7.82,11.34 7.84,11.33 7.84,9.77 8.59,9.02 8.59,8.2 8.88,7.9 8.88,5.24 v9.32,4.79
  Bottom 0.203: v7.82,11.34 7.82,12.13 9.82,14.12 9.82,16.2 8.79,17.23 8.79,19.44 10.5,21.16 11.27,21.16 11.99,20.43 11.99,19 13.04,17.95 P1.4 | U$3.1 5.84,4.35 6.15,4.04 8.73,4.04 9.32,4.63 v9.32,4.79
CA2
  Bottom 0.152: 0.28,14.77 0.28,13.44 0.54,13.18
  Bottom 0.2: U$3.11 0.54,10.16 0.54,13.18
  Bottom 0.203: 0.28,14.77 2.53,17.02 2.53,20.69 4.19,22.35 12.14,22.35 14.28,20.22 15.51,20.22 15.96,19.77 15.96,19.09 14.82,17.95 P1.2
DACSELECT
  Bottom 0.203: U$1.6 22.55,12.9 22.07,12.43 22.07,10.45 22.5,10.02 22.5,9.25 21.96,8.71 17.19,8.71 U4.8
ENABLE  (via drill 0.25)
  Top 0.203: v16.32,7.11 16.32,5.16 15.88,4.71 10.26,4.71 9.52,5.45 v9.52,6.3
  Bottom 0.203: U$3.18 7.59,6.15 7.8,6.35 9.46,6.35 v9.52,6.3
  Bottom 0.254: v16.32,7.11 16.28,7.07 U4.12
FLIP  (via drill 0.25)
  Top 0.152: v6.43,2.26 6.71,2.54 7.78,2.54 8,2.76 8,4.29 7.33,4.96 v7.13,4.96
  Top 0.203: v7.13,4.96 7.13,5.24 7.14,5.25 7.14,6.7 v7.27,6.82 | v9.49,7.1 10.72,7.1 11.05,6.77 13.79,6.77 14.05,7.04 14.05,8.01 14.37,8.32 18.51,8.32 19.71,9.53 19.71,10.57 19.38,10.9 17.02,10.9 15.95,11.96 v15.95,14.33
  Bottom 0.203: U$3.19 6.44,5.65 v7.13,4.96 | U$3.17 7.09,6.65 v7.27,6.82 7.3,6.79 9.05,6.79 9.36,7.1 v9.49,7.1 | v6.43,2.26 6.11,2.58 1.64,2.58 0.98,3.24 0.98,5.42 1.71,6.15 U$3.8 | U4.41 14.78,13.55 15.56,14.33 v15.95,14.33
  Bottom 0.305: U$3.9 U$3.8
FUEL_GPIO  (via drill 0.25)
  Top 0.152: v3.76,11.87 3.83,11.94
  Top 0.254: 3.83,11.94 U2.12
  Bottom 0.254: R4.2 4.71,9.89 3.76,10.85 v3.76,11.87
GND  (via drill 0.25)
  Top 0.152: U2.EP2 4.55,8.87 arc90 U2.EP | R3.1 3.28,8.87 | U2.EP4 6.75,11.07 6.1,10.41 | 6.1,10.41 U2.EP | U2.EP1 5.44,11.07 arc-90 6.1,10.41 | U2.EP3 6.75,8.87 arc-90 U2.EP | 4.31,3.58 arc90 S1.1 | C1.2 10.62,6.34 v10.41,6.54 | 4.28,6.36 4.01,6.36 v3.75,6.1
  Top 0.203: C6.2 4.28,6.36 C4.1 | C4.1 4.69,4.94 4.31,4.56 4.31,3.58 | U2.3 5.45,7.08 4.69,6.31 C4.1 | R11.2 13.07,5.92 13.82,5.16 15.36,5.16 v15.51,5.31
  Top 0.254: U2.3 5.45,9.77 U2.EP | 3.28,8.87 U2.EP2 | S1.1 5.19,3.5 v5.32,3.63
  Top 0.406: C5.2 11.28,7.96 v11.28,7.47
  Top 0.508: R9.2 9.54,19.05 P1.P$2
  Bottom 0.152: U$1.G1 U$1.3 | U4.5 16.71,10.22 16.51,10.41 16.51,11.18 16.48,11.15 | v16,11.07 16.41,11.07 16.48,11.15 | v11.28,7.47 11.03,7.21 U4.23 10.41,7.18 v10.41,6.54 | U$3.4 U$3.3 v3.75,6.1 U$3.EPAD | 16.66,12.57 16.48,12.4 16.48,11.15
  Bottom 0.203: C9.1 26.29,10.73 26.02,11 24.65,11 U$1.G1 | v15.51,5.31 15.3,5.31 14.78,5.83 U4.15 | U4.43 15.79,13.53 16.02,13.77 16.43,13.77 16.66,13.99 | 16.83,14.16 16.7,14.04 16.66,13.99 | 16.66,12.57 16.66,13.99
  Bottom 0.254: U4.35 v11.78,18.23 v11.79,18.24 | 16.83,14.16 16.83,14.38 v16.84,14.39 | 4.77,18.23 4.77,16.61 3.97,15.81 J2.P$2 | R17.2 18.23,4.95 v16.85,4.95
  Bottom 0.406: v20.62,0.76 19.95,0.76 R15.2
  other vias: 26.38,4.65 24.05,3.96 14.68,15.43 9.75,13.18
  pour Top: -2.54,25.4 31.24,25.4 31.24,-2.54 -2.54,-2.54
  pour Bottom: 31.24,25.4 -2.54,25.4 -2.54,-2.29 31.24,-2.55
MISO
  Bottom 0.305: U9.P2 18.08,7.21 U4.11
MOSI
  Bottom 0.152: U9.P3 21.72,6.28 22.45,7.01 22.48,7.04 22.83,7.4 22.83,10.42 22.43,10.82 22.43,11.96 22.66,12.19 24.04,12.19 24.22,12.37 U$1.8
  Bottom 0.305: U4.10 18.68,7.71 20.8,5.59 21.71,5.59 U9.P3
N$1
  Bottom 0.203: R14.1 27.09,6.71 U$2.P$1
  Bottom 0.254: U$2.P$1 25.46,4.85 25.46,3.59 Q3.2
N$2
  Bottom 0.152: R15.1 19.36,2.68 19.3,2.63 17.61,2.63 17.11,2.13 16.2,2.13 Q4.2
  Bottom 0.203: U$2.P$7 24.68,7.06 23.29,5.66 23.03,5.66 22.89,5.51 22.89,2.77 22.49,2.38 20.04,2.38 R15.1
N$3
  Bottom 0.203: U$2.P$6 24.03,7.05 23.15,6.17 22.94,6.17 22.52,5.75 22.52,3.2 22.11,2.79 21.2,2.79 20.43,3.56 18.53,3.56 R17.1 18.38,3.35 18.03,3.01 16.84,3.01 16.77,2.93 Q4.3
N$4
  Top 0.508: J1.P$2 11.99,3.85 11.9,3.95 10.67,3.95 C1.1
  Top 0.61: C1.1 9.42,4 S1.3
N$5
  Bottom 0.203: U$2.P$2 24.69,3.75 24.69,3.06 | Q3.3 25.97,2.55 25.21,2.55 24.69,3.06 | 24.69,3.06 24.32,2.69 R16.1
N$8
  Top 0.406: R2.1 11.67,14.91 LED1.C
N$10
  Top 0.305: R5.1 17.59,13.54 U3.3
  Top 0.406: R5.1 19.59,13.44 R6.2
N$12
  Bottom 0.152: 11.59,4.39 8MHZ.1
  Bottom 0.254: U4.17 13.77,6.31 13.77,5.86 13.24,5.33 12.45,5.33 11.59,4.48 11.59,4.39
N$13
  Bottom 0.254: 8MHZ.3 13.97,3.64 13.97,4.89 14.29,5.2 U4.16
N$14  (via drill 0.25, 0.25 pad 0.25)
  Top 0.203: v13.72,11.43 10.6,14.54 10.6,15.2 9.08,16.72 6.85,16.72 4.61,14.48 3.3,14.48 2.54,15.24 2.54,18.29 3.33,19.08 J2.P1
  Top 0.305: v13.72,9.53 13.8,9.61 15.2,9.61 v15.23,9.59
  Bottom 0.305: v13.72,9.53 v13.72,11.43 | U4.7 15.6,9.22 v15.23,9.59
N$15
  Top 0.254: L1.P$3 L1.P$1 | U3.1 17.97,11.69 18.8,12.51 D1.ANODE
  Top 0.406: D1.ANODE 24.7,14.97 L1.P$3
N$16  (via drill 0.25 pad 0.25)
  Top 0.254: R7.1 8.55,17.96 9.87,16.64 14.53,16.64 15.58,15.58 18.47,15.58 v18.66,15.77
  Bottom 0.203: U4.4 17.93,10.72 18.5,11.29 18.5,15.62 v18.66,15.77
N$17  (via drill 0.25 pad 0.25)
  Top 0.254: R8.2 5.94,20.85 7.48,20.85 8.64,19.7 8.64,18.48 9.97,17.14 14.93,17.14 15.75,16.32 v18.02,16.32
  Bottom 0.203: v18.02,16.32 18.02,11.65 17.59,11.22 U4.3
N$18
  Top 0.305: 5.92,17.78 R7.2
  Top 0.406: J2.P3 5.92,17.78
N$19
  Top 0.406: J2.P2 4.99,18.43 R8.1
N$20
  Top 0.406: R11.1 14.48,6.5 14.87,6.9 LED3.C
N$21  (via drill 0.25)
  Top 0.305: S3.P$1 17.45,10.08 16.19,8.83 13.27,8.83 12.74,9.35 v11.68,9.35
  Bottom 0.305: U4.27 11.5,9.22 11.64,9.35 v11.68,9.35
N$22
  Bottom 1.016: U9.P9 7.49,16.2 7.49,19.56 TUN1.1
N$24
  Top 0.152: 9.67,22.05 R9.1
  Top 0.305: LED2.C 9.67,22.05
N$25  (via drill 0.35)
  Top 0.305: v14.29,22.04 12.99,22.04 LED2.A
  Bottom 0.305: U4.36 12.28,14.06 16.51,18.29 16.51,19.81 v14.29,22.04
N$26
  Top 0.203: U2.10 5.45,12.58 5.34,12.69 3.7,12.69 3.19,12.18 3.19,10.86 R3.2
N$28  (via drill 0.25)
  Top 0.203: v1.09,11.18 1.09,7.94 v1.07,7.91
  Bottom 0.203: v1.07,7.91 0.48,7.33 0.48,3.23 3.07,0.64 15.92,0.64 16.12,0.83 Q4.1 | U$3.16 5.55,7.22 5.67,7.35 5.67,12.02 6.45,12.8 | 6.45,12.8 6.45,12.81 | 6.45,12.8 6.45,12.81 | U$3.12 3.25,8.36 1.09,10.51 v1.09,11.18 1.09,12.06 0.9,12.26 0.9,12.78 1.27,13.14 3.71,13.14 5,14.42 5.62,14.42 6.45,13.59 6.45,12.81
N$29  (via drill 0.25)
  Top 0.203: v12.11,7.53 12.24,7.66 LED3.A
  Bottom 0.203: U4.26 10.93,8.72 v12.11,7.54 v12.11,7.53
N$32
  Bottom 0.152: 24.03,5.3 24.03,5.08 U$2.P$3
  Bottom 0.203: U$1.1 25.27,9.91 27.04,9.91 27.56,9.39 27.56,8.26 25.83,6.53 25.22,6.53 24.03,5.34 24.03,5.3
N$33
  Bottom 0.254: U$2.P$5 23.37,8.06 24.72,9.41 U$1.2
N$36
  Bottom 0.152: 15.69,1.82 17.24,1.82 17.29,1.88 17.33,1.88
  Bottom 0.203: U$3.7 1.92,5.62 1.68,5.62 1.33,5.27 1.33,3.52 1.82,3.04 3.77,3.04 4.24,3.5 | U$3.2 4.25,3.51 4.24,3.5 | 4.24,3.5 4.72,3.02 8.91,3.02 10.86,1.08 14.95,1.08 15.69,1.82 | 20.32,1.88 21.4,0.79 22.61,0.79 23.61,1.8 26.11,1.8 Q3.1 | 20.32,1.88 | 17.33,1.88 20.32,1.88
RADIO_INT
  Bottom 0.254: U4.21 11.78,5.84 11.52,5.57 U9.P14
RADIO_SELECT
  Bottom 0.152: 20.23,9.57 R13.1
  Bottom 0.254: R13.1 19.05,10.53 19.05,15.15 19.3,15.4 19.3,16.35 18.74,16.91 17.72,16.91 17.42,16.62 17.42,12.46 U4.1
  Bottom 0.356: U9.P5 20.23,9.57
RESET  (via drill 0.25)
  Top 0.305: v17.27,5.59 20.29,5.59 21.36,4.51 22.54,4.51 23.17,3.88 23.17,2.85 S2.P$2
  Bottom 0.254: v17.27,5.59 16.06,5.59 15.78,5.87 U4.13
SCK  (via drill 0.25)
  Top 0.305: v20.43,10.47 20.83,10.07 20.83,8.79 21.72,7.89 U9.P4
  Bottom 0.203: v20.43,10.47 21.26,10.47 21.68,10.89 21.68,12.54 22.73,13.58 23.46,13.58 23.72,13.33 U$1.7
  Bottom 0.305: U4.9 21.08,8.22 U9.P4
SCL  (via drill 0.25)
  Top 0.203: U2.2 5.05,7.46 4.9,7.32 3.05,7.32 2.05,8.31 2.05,11.73 2.44,12.12 2.44,12.57 3.37,13.51 v3.37,13.82 3.41,13.86 4.49,13.86 7,16.36 8.83,16.36 10.17,15.03 10.17,14.35 12.7,11.82 v12.7,11.43
  Bottom 0.254: v12.7,11.43 12.7,9.45 13.28,8.87 U4.18 | v3.37,13.82 3.37,14.63 3.09,14.91 3.09,15.92 3.94,16.76 R10.2
SDA  (via drill 0.25)
  Top 0.203: v11.68,11.43 11.68,12.14 9.7,14.13 8.91,14.13 8.63,14.41 7.58,14.41 6.24,13.07 v5.89,13.07 3.52,13.07 2.82,12.38 2.82,11.89 2.43,11.5 2.43,8.47 2.91,8 U2.1
  Bottom 0.254: v11.68,11.43 12.29,10.82 12.29,9.23 12.78,8.74 U4.19
  Bottom 0.33: R12.2 4.78,11.96 v5.89,13.07

### Text on the board
tNames: Cerebro 5.11_DBS | BTN | + | - | RST | Off | On
bNames: Serial# | Cerebro / 5.11_DBS | DAC | 3.3V | sck | mosi | opamp | miso | ADG1434 | gnd